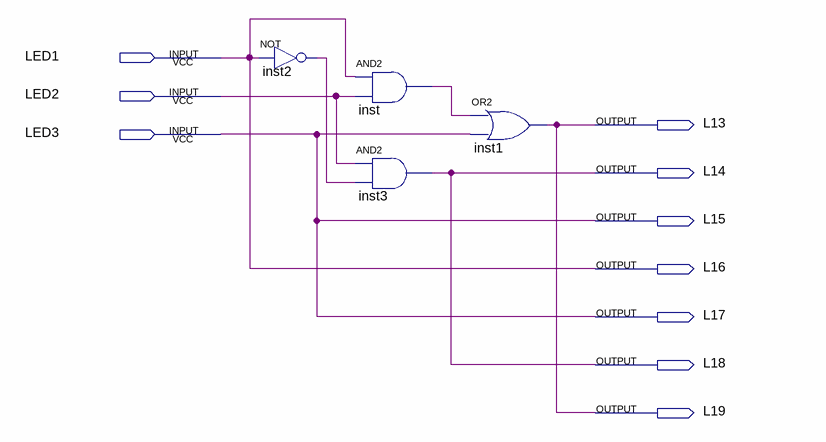
[diagram p0: schematic sheet]
// Quartus schematic LED_dice.bdf as structural Verilog: 4 symbols, 10 pins
module LED_dice (
  input  LED1,
  input  LED2,
  input  LED3,
  output L13,
  output L14,
  output L15,
  output L16,
  output L17,
  output L18,
  output L19
);

  wire inst2_out, inst_out;

  not inst2 (inst2_out, LED1);
  and inst (inst_out, LED1, LED2);
  and inst3 (L14, LED2, inst2_out);
  or inst1 (L13, inst_out, LED3);

  assign L15 = LED3;
  assign L16 = LED1;
  assign L17 = LED3;
  assign L18 = L14;
  assign L19 = L13;
endmodule
